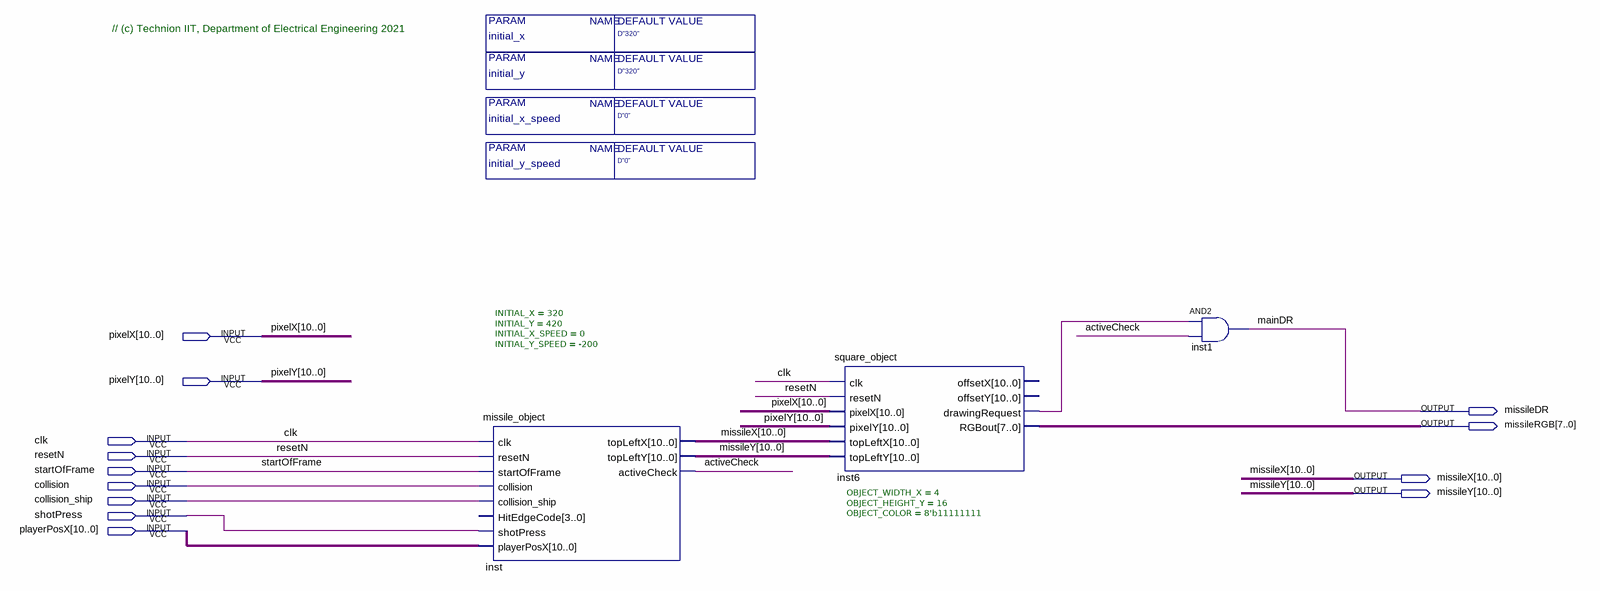
[diagram p0: schematic sheet]
// Quartus schematic Missile_Block.bdf as structural Verilog: 3 symbols, 13 pins
module Missile_Block #(parameter initial_x_speed = "D\"0\"", parameter initial_y = "D\"320\"", parameter initial_x = "D\"320\"", parameter initial_y_speed = "D\"0\"") (
  input  [10:0] pixelX,
  input  [10:0] pixelY,
  input  clk,
  input  resetN,
  input  startOfFrame,
  input  collision,
  input  collision_ship,
  input  shotPress,
  input  [10:0] playerPosX,
  output missileDR,
  output [7:0] missileRGB,
  output [10:0] missileX,
  output [10:0] missileY
);

  wire activeCheck, inst6_drawingrequest;

  missile_object #(.INITIAL_X(320), .INITIAL_Y(420), .INITIAL_X_SPEED(0), .INITIAL_Y_SPEED(-200)) inst (
    .clk(clk), .resetN(resetN), .startOfFrame(startOfFrame), .collision(collision),
    .collision_ship(collision_ship), .shotPress(shotPress), .playerPosX(playerPosX), .topLeftX(missileX),
    .topLeftY(missileY), .activeCheck(activeCheck));  // open: HitEdgeCode
  square_object #(.OBJECT_WIDTH_X(4), .OBJECT_HEIGHT_Y(16), .OBJECT_COLOR(8'b11111111)) inst6 (
    .clk(clk), .resetN(resetN), .pixelX(pixelX), .pixelY(pixelY), .topLeftX(missileX), .topLeftY(missileY),
    .drawingRequest(inst6_drawingrequest), .RGBout(missileRGB));  // open: offsetX, offsetY
  and inst1 (missileDR, inst6_drawingrequest, activeCheck);

  // Other names for the same wires on the sheet: mainDR = missileDR

  // Notes on the sheet:
  //   // (c) Technion IIT, Department of Electrical Engineering 2021
endmodule
